# Altium schematic sheet [003] Connectors.SchDoc
size A4
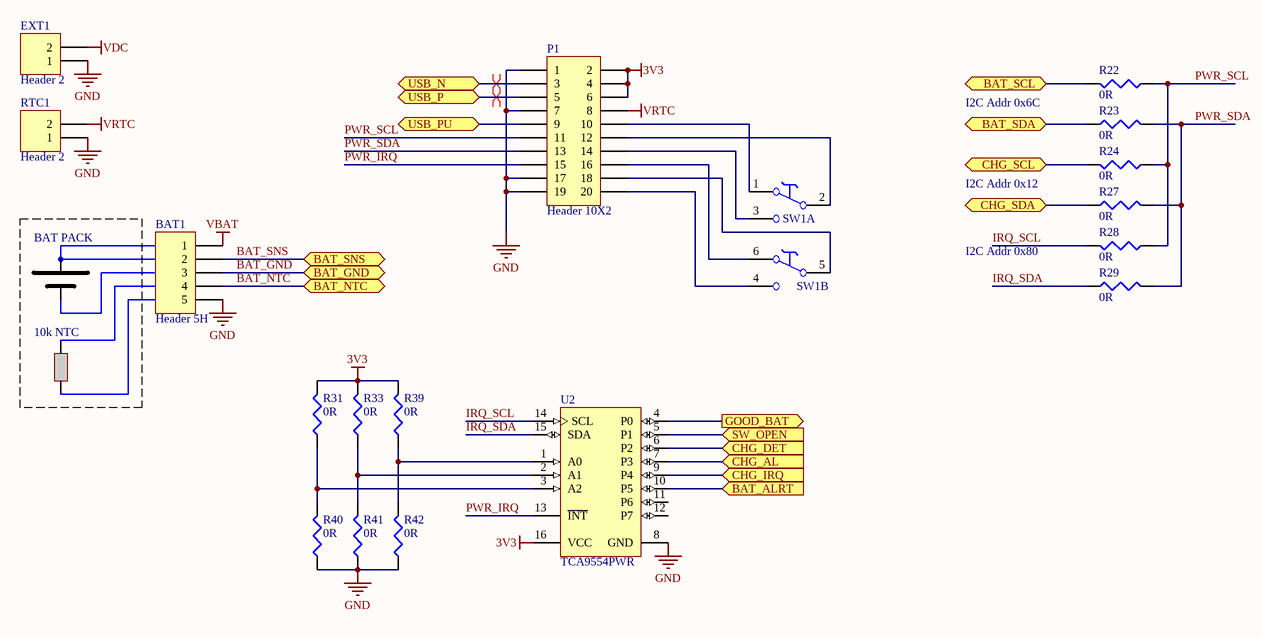
[diagram p0: [003] Connectors.SchDoc]

## Parts
BAT1  Header 5H  [MOLEX-705530004]
EXT1  Header 2  [MOLEX-705530001]
P1  Header 10X2  [SAMTEC_TSW-110-07-L-D-LL]
R22  value 0R  [J1-0603]  (hidden comment: Res3)
R23  value 0R  [J1-0603]  (hidden comment: Res3)
R24  value 0R  [J1-0603]  (hidden comment: Res3)
R27  value 0R  [J1-0603]  (hidden comment: Res3)
R28  value 0R  [J1-0603]  (hidden comment: Res3)
R29  value 0R  [J1-0603]  (hidden comment: Res3)
R31  value 0R  [J1-0603]  (hidden comment: Res3)
R33  value 0R  [J1-0603]  (hidden comment: Res3)
R39  value 0R  [J1-0603]  (hidden comment: Res3)
R40  value 0R  [J1-0603]  (hidden comment: Res3)
R41  value 0R  [J1-0603]  (hidden comment: Res3)
R42  value 0R  [J1-0603]  (hidden comment: Res3)
RTC1  Header 2  [MOLEX-705530001]
SW1  Switch  [EG2215]  (value not drawn)  (parts A,B of 2)
U2  TCA9554PWR  [PW16_N]

## Ports
BAT_ALRT (in), BAT_GND (bidir), BAT_NTC (bidir), BAT_SCL (bidir), BAT_SDA (bidir), BAT_SNS (bidir), CHG_AL (in), CHG_DET (in), CHG_IRQ (in), CHG_SCL (bidir), CHG_SDA (bidir), GOOD_BAT (out), SW_OPEN (in), USB_N (bidir), USB_P (bidir), USB_PU (bidir)

## Nets
3V3: P1.2 P1.4 P1.6 R31.2 R33.2 R39.2 U2.16(VCC)
GND: BAT1.5 EXT1.1 P1.1 P1.7 P1.17 P1.19 R40.1 R41.1 R42.1 RTC1.1 U2.8(GND)
VBAT: BAT1.1
VDC: EXT1.2
VRTC: P1.8 RTC1.2
BAT_ALRT: U2.10(P5) ; port BAT_ALRT
BAT_GND: BAT1.3 ; port BAT_GND
BAT_NTC: BAT1.4 ; port BAT_NTC
BAT_SCL: R22.2 ; port BAT_SCL
BAT_SDA: R23.1 ; port BAT_SDA
BAT_SNS: BAT1.2 ; port BAT_SNS
CHG_AL: U2.7(P3) ; port CHG_AL
CHG_DET: U2.6(P2) ; port CHG_DET
CHG_IRQ: U2.9(P4) ; port CHG_IRQ
CHG_SCL: R24.2 ; port CHG_SCL
CHG_SDA: R27.1 ; port CHG_SDA
GOOD_BAT: U2.4(P0) ; port GOOD_BAT
IRQ_SCL: R28.2 U2.14(SCL)
IRQ_SDA: R29.1 U2.15(SDA)
PWR_IRQ: P1.15 U2.13(~{INT})
PWR_SCL: P1.11 R22.1 R24.1 R28.1
PWR_SDA: P1.13 R23.2 R27.2 R29.2
SW_OPEN: U2.5(P1) ; port SW_OPEN
USB_N: P1.3 ; port USB_N
USB_P: P1.5 ; port USB_P
USB_PU: P1.9 ; port USB_PU
NetP1_10: P1.10 SW1.1
NetP1_12: P1.12 SW1.2
NetP1_14: P1.14 SW1.3
NetP1_16: P1.16 SW1.6
NetP1_18: P1.18 SW1.5
NetP1_20: P1.20 SW1.4
NetR31_1: R31.1 R40.2 U2.3(A2)
NetR33_1: R33.1 R41.2 U2.2(A1)
NetR39_1: R39.1 R42.2 U2.1(A0)

Not connected (* = marked no-connect by the designer): U2 11(P6) 12(P7)

## Layout directives
differential pair: USB_N, USB_P

## Notes on the sheet
- I2C Addr 0x6C
- BAT PACK
- I2C Addr 0x12
- I2C Addr 0x80
- 10k NTC

## Library data of the parts
BAT1 = Header 5H: Header, 5-Pin, Right Angle; LatestRevisionDate: 17-Jul-2002; LatestRevisionNote: Re-released for DXP Platform.; Publisher: Altium Limited
EXT1 RTC1 = Header 2: Header, 2-Pin; LatestRevisionDate: 17-Jul-2002; LatestRevisionNote: Re-released for DXP Platform.; Publisher: Altium Limited
P1 = Header 10X2: Header, 10-Pin, Dual row; LatestRevisionDate: 17-Jul-2002; LatestRevisionNote: Re-released for DXP Platform.; Publisher: Altium Limited
R22-R24 R27-R29 R31 R33 R39-R42 = Res3: Resistor; Published: 8-Jun-2000; LatestRevisionDate: 29-May-2009; LatestRevisionNote: IPC-7351 Footprint Added.; PackageReference: J1-0603; Publisher: Altium Limited; PackageDescription: Chip Resistor
SW1 = SW_TYCO_1825010-5: DPDTSwitch; Part Description: Surface Mount DPDT Slide DIP Switch, Extented Top Actuator, Contact Rating 300mA @ 115VDC; Manufacturer: TYCO; Manufacturer Part Number: 1825010-5 or ASE22GL04; PressFit: No; Part Number: SW_TYCO_1825010-5; Component Kind: Standard; Component Type: Standard; Footprint: SW_TYCO_1825010-5; Pin Count: 6; PackageDescription: Pitch 2.54mm,  Body 10.16x7.36mm, DPDT  SMD Slide DIP Switch, Extented Top Actuator, TYCO ASE/F Series; Family: Switch; Mounted: Yes; Socket: No; SMD: Yes; Sense: No; Status: None; ComponentHeight: 8.14mm; HelpURL: \\cern.ch\dfs\Applications\Altium\Datasheets\SW_TYCO_1825010-5.pdf; Author: CERN DEM JLC; CreateDate: 26.02.2015; LatestRevisionDate: 26.02.2015
U2 = TCA9554PWR: Remote 8-Bit I2C and SMBus I/O Expander, 1.65 to 5.5 V, -40 to 85 degC, 16-pin TSSOP (PW), Green (RoHS & no Sb/Br); Manufacturer: Texas Instruments; SubFamily: I2C IO Expander; Interrupt Output: Yes; fSCLK(Max)(MHz): 401; VCC(Min)(V): 1.65; VCC(Max)(V): 5.5; Max Frequency(kHz): 400; I2C Address: 0100xxx; # of I/Os: 8; DatasheetVersion: SCPS233; PackageVersion: revG, Feb-2011; PackageReference: PW16; PackageDescription: 16-Pin Plastic Thin Small Outline Package 5 x 4.4 mm Body ,0.65 mm Pitch; Supplier 1: Digi-Key; Supplier Part Number 1: 296-30135-2-ND; Supplier 2: Digi-Key; Supplier Part Number 2: 296-30135-1-ND; Supplier 3: Digi-Key; Supplier Part Number 3: 296-30135-6-ND; Supplier 4: Newark; Supplier Part Number 4: 76T8038; Supplier 5: Mouser; Supplier Part Number 5: 595-TCA9554PWR; Eco-Plan: Green (RoHS & no Sb/Br); Vcc range(V): 1.65 to 5.5; Low Power: Yes; Configuration Registers: Yes; 5V Tolerant I/O: Yes; Mounting Technology: Surface Mount; PartNumber: TCA9554PWR; Code_JEDEC: MO-153; ComponentLink1Description: Datasheet; ComponentLink1URL: http://www.ti.com/general/docs/lit/getliterature.tsp?genericPartNumber=TCA9554&fileType=pdf